# Altium schematic sheet LightLinkV3.SchDoc
size B; SheetNumber: 7; SheetTotal: 8
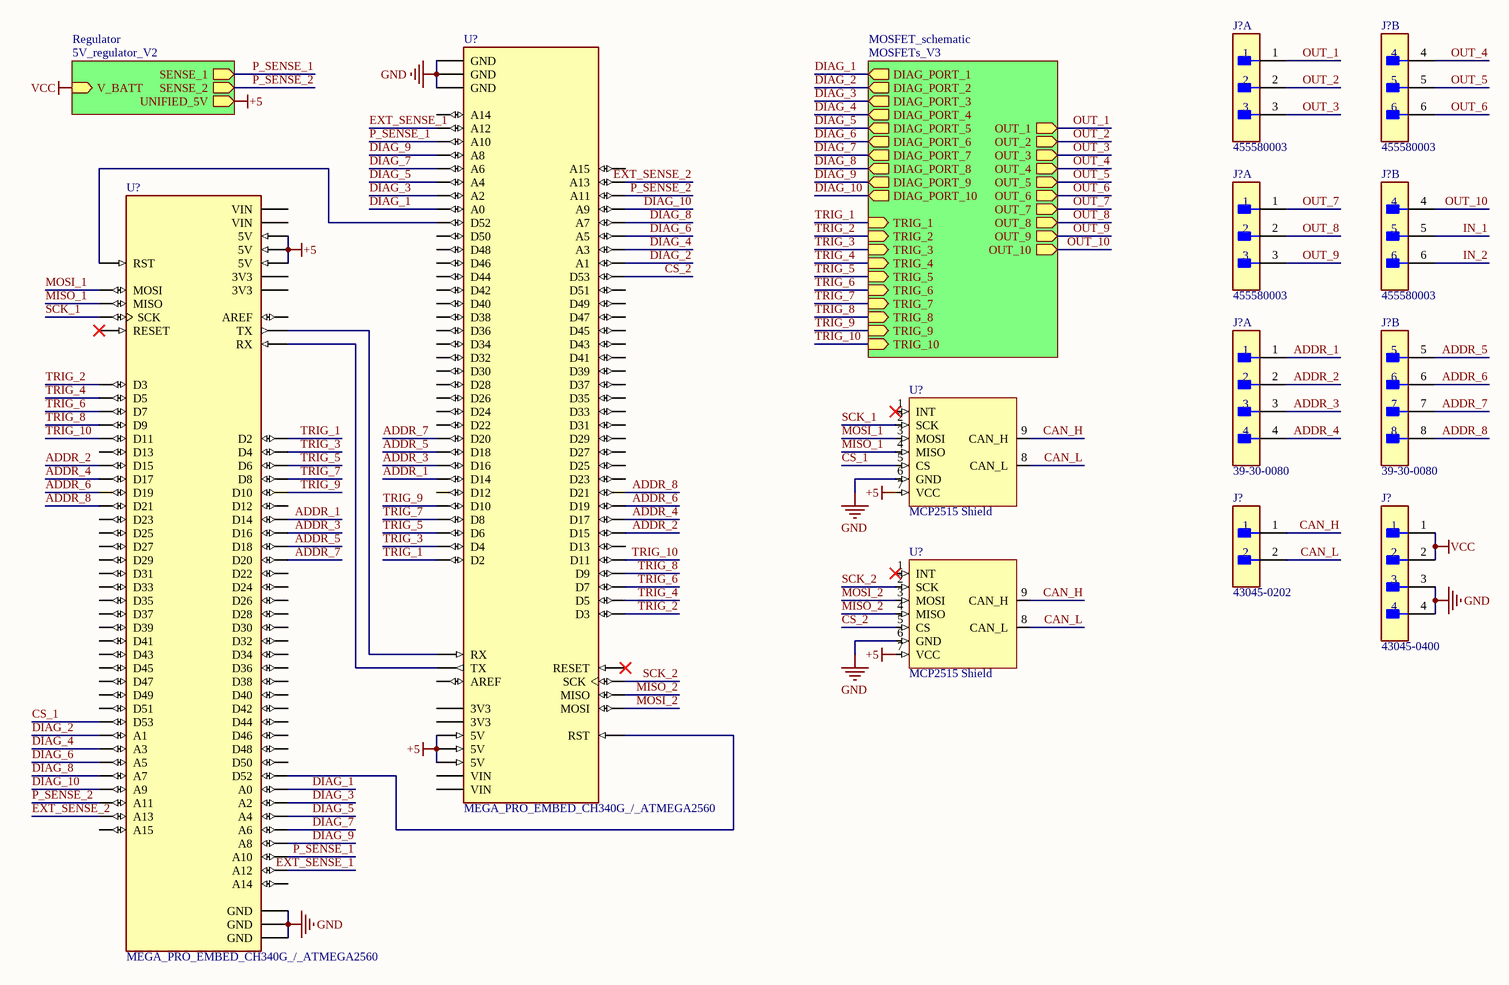
[diagram p0: LightLinkV3.SchDoc]

## Parts
(Parts that share a designator on the sheet are numbered #1, #2 ... from top to bottom, then left to right.)
J?#1  455580003  [FP-455580003-MFG]  (part A of 2)
J?#2  455580003  [FP-455580003-MFG]  (part B of 2)
J?#3  455580003  [FP-455580003-MFG]  (part A of 2)
J?#4  455580003  [FP-455580003-MFG]  (part B of 2)
J?#5  39-30-0080  [FP-39-30-0080-MFG]  (part A of 2)
J?#6  39-30-0080  [FP-39-30-0080-MFG]  (part B of 2)
J?#7  43045-0202  [FP-43045-0202-MFG]
J?#8  43045-0400  [FP-43045-0400-MFG]
U?#1  MCP2515 Shield  [MCP2515 Shield-Footprint-1]
U?#2  MEGA_PRO_EMBED_CH340G_/_ATMEGA2560  [MODULE_MEGA_PRO_EMBED_CH340G_/_ATMEGA2560]
U?#3  MEGA_PRO_EMBED_CH340G_/_ATMEGA2560  [MODULE_MEGA_PRO_EMBED_CH340G_/_ATMEGA2560]
U?#4  MCP2515 Shield  [MCP2515 Shield-Footprint-1]

## Sub-sheets
MOSFET_schematic = MOSFETs_V3: DIAG_PORT_1 (out), TRIG_1 (in), DIAG_PORT_2 (out), TRIG_2 (in), DIAG_PORT_3 (out), TRIG_3 (in), DIAG_PORT_4 (out), TRIG_4 (in), OUT_4 (out), OUT_3 (out), OUT_2 (out), OUT_1 (out), DIAG_PORT_5 (out), TRIG_5 (in), DIAG_PORT_6 (out), TRIG_6 (in), DIAG_PORT_7 (out), TRIG_7 (in), DIAG_PORT_8 (out), TRIG_8 (in), OUT_8 (out), OUT_7 (out), OUT_6 (out), OUT_5 (out), DIAG_PORT_9 (out), TRIG_9 (in), OUT_9 (out), DIAG_PORT_10 (out), TRIG_10 (in), OUT_10 (out)
Regulator = 5V_regulator_V2: UNIFIED_5V (out), V_BATT (in), SENSE_1 (out), SENSE_2 (out)

## Nets
+5: U?#1.7(VCC) U?#2.5V_1(5V) U?#2.5V_2(5V) U?#2.5V_3(5V) U?#3.5V_1(5V) U?#3.5V_2(5V) U?#3.5V_3(5V) U?#4.7(VCC) ; sheet Regulator/UNIFIED_5V
GND: J?#8.3 J?#8.4 U?#1.6(GND) U?#2.GND_1(GND) U?#2.GND_2(GND) U?#2.GND_3(GND) U?#3.GND_1(GND) U?#3.GND_2(GND) U?#3.GND_3(GND) U?#4.6(GND)
VCC: J?#8.1 J?#8.2 ; sheet Regulator/V_BATT
ADDR_1: J?#5.1 U?#2.D14 U?#3.D14
ADDR_2: J?#5.2 U?#2.D15 U?#3.D15
ADDR_3: J?#5.3 U?#2.D16 U?#3.D16
ADDR_4: J?#5.4 U?#2.D17 U?#3.D17
ADDR_5: J?#6.5 U?#2.D18 U?#3.D18
ADDR_6: J?#6.6 U?#2.D19 U?#3.D19
ADDR_7: J?#6.7 U?#2.D20 U?#3.D20
ADDR_8: J?#6.8 U?#2.D21 U?#3.D21
CAN_H: J?#7.1 U?#1.9(CAN_H) U?#4.9(CAN_H)
CAN_L: J?#7.2 U?#1.8(CAN_L) U?#4.8(CAN_L)
CS_1: U?#1.5(CS) U?#3.D53
CS_2: U?#2.D53 U?#4.5(CS)
DIAG_1: U?#2.A0 U?#3.A0 ; sheet MOSFET_schematic/DIAG_PORT_1
DIAG_2: U?#2.A1 U?#3.A1 ; sheet MOSFET_schematic/DIAG_PORT_2
DIAG_3: U?#2.A2 U?#3.A2 ; sheet MOSFET_schematic/DIAG_PORT_3
DIAG_4: U?#2.A3 U?#3.A3 ; sheet MOSFET_schematic/DIAG_PORT_4
DIAG_5: U?#2.A4 U?#3.A4 ; sheet MOSFET_schematic/DIAG_PORT_5
DIAG_6: U?#2.A5 U?#3.A5 ; sheet MOSFET_schematic/DIAG_PORT_6
DIAG_7: U?#2.A6 U?#3.A6 ; sheet MOSFET_schematic/DIAG_PORT_7
DIAG_8: U?#2.A7 U?#3.A7 ; sheet MOSFET_schematic/DIAG_PORT_8
DIAG_9: U?#2.A8 U?#3.A8 ; sheet MOSFET_schematic/DIAG_PORT_9
DIAG_10: U?#2.A9 U?#3.A9 ; sheet MOSFET_schematic/DIAG_PORT_10
EXT_SENSE_1: U?#2.A12 U?#3.A12
EXT_SENSE_2: U?#2.A13 U?#3.A13
IN_1: J?#4.5
IN_2: J?#4.6
MISO_1: U?#1.4(MISO) U?#3.MISO
MISO_2: U?#2.MISO U?#4.4(MISO)
MOSI_1: U?#1.3(MOSI) U?#3.MOSI
MOSI_2: U?#2.MOSI U?#4.3(MOSI)
OUT_1: J?#1.1 ; sheet MOSFET_schematic/OUT_1
OUT_2: J?#1.2 ; sheet MOSFET_schematic/OUT_2
OUT_3: J?#1.3 ; sheet MOSFET_schematic/OUT_3
OUT_4: J?#2.4 ; sheet MOSFET_schematic/OUT_4
OUT_5: J?#2.5 ; sheet MOSFET_schematic/OUT_5
OUT_6: J?#2.6 ; sheet MOSFET_schematic/OUT_6
OUT_7: J?#3.1 ; sheet MOSFET_schematic/OUT_7
OUT_8: J?#3.2 ; sheet MOSFET_schematic/OUT_8
OUT_9: J?#3.3 ; sheet MOSFET_schematic/OUT_9
OUT_10: J?#4.4 ; sheet MOSFET_schematic/OUT_10
P_SENSE_1: U?#2.A10 U?#3.A10 ; sheet Regulator/SENSE_1
P_SENSE_2: U?#2.A11 U?#3.A11 ; sheet Regulator/SENSE_2
SCK_1: U?#1.2(SCK) U?#3.SCK
SCK_2: U?#2.SCK U?#4.2(SCK)
TRIG_1: U?#2.D2 U?#3.D2 ; sheet MOSFET_schematic/TRIG_1
TRIG_2: U?#2.D3 U?#3.D3 ; sheet MOSFET_schematic/TRIG_2
TRIG_3: U?#2.D4 U?#3.D4 ; sheet MOSFET_schematic/TRIG_3
TRIG_4: U?#2.D5 U?#3.D5 ; sheet MOSFET_schematic/TRIG_4
TRIG_5: U?#2.D6 U?#3.D6 ; sheet MOSFET_schematic/TRIG_5
TRIG_6: U?#2.D7 U?#3.D7 ; sheet MOSFET_schematic/TRIG_6
TRIG_7: U?#2.D8 U?#3.D8 ; sheet MOSFET_schematic/TRIG_7
TRIG_8: U?#2.D9 U?#3.D9 ; sheet MOSFET_schematic/TRIG_8
TRIG_9: U?#2.D10 U?#3.D10 ; sheet MOSFET_schematic/TRIG_9
TRIG_10: U?#2.D11 U?#3.D11 ; sheet MOSFET_schematic/TRIG_10
NetU?#2_D52: U?#2.D52 U?#3.RST
NetU?#2_RST: U?#2.RST U?#3.D52
NetU?#2_RX: U?#2.RX U?#3.TX
NetU?#2_TX: U?#2.TX U?#3.RX

Not connected (* = marked no-connect by the designer): U?#1 1(INT)*; U?#2 3V3_1(3V3) 3V3_2(3V3) A14 A15 AREF D12 D13 D22 D23 D24 D25 D26 D27 D28 D29 D30 D31 D32 D33 D34 D35 D36 D37 D38 D39 D40 D41 D42 D43 D44 D45 D46 D47 D48 D49 D50 D51 RESET* VIN_1(VIN) VIN_2(VIN); U?#3 3V3_1(3V3) 3V3_2(3V3) A14 A15 AREF D12 D13 D22 D23 D24 D25 D26 D27 D28 D29 D30 D31 D32 D33 D34 D35 D36 D37 D38 D39 D40 D41 D42 D43 D44 D45 D46 D47 D48 D49 D50 D51 RESET* VIN_1(VIN) VIN_2(VIN); U?#4 1(INT)*

## Library data of the parts
J?#1-J?#4 = CMP-04776-000024-1: CONN HEADER R/A 6POS 4.2MM; Manufacturer: Molex; Standoff Height: 0.4mm; Conn Orientation: Right Angle; Number Of Contacts: 6; Conn Gender: Male; Voltage Rating: 600V; Current Rating: 8A; Footprint Url: https://www.molex.com/pdm_docs/sd/455580003_sd.pdf; Number Of Rows: 2; Lead Free: Yes; Digikey Description: CONN HEADER R/A 6POS 4.2MM; ComponentLink2URL: https://www.molex.com/webdocs/datasheets/pdf/en-us/0455580003_PCB_HEADERS.pdf; Octopart: https://octopart.com/45558-0003-molex-7672845; Package: 0; Device Class L3: unset; ComponentLink2Description: Datasheet; Device Class L2: Headers and Wire Housings; Category: Conn; Contact Material: Tin,Nickel; Mouser Description: Conn Power HDR 6 POS 4.2mm Solder ST Thru-Hole 6 Terminal 1 Port Mini-Fit Jr™ Tray; Manufacturer Part Number: 455580003; Pitch: 4.2mm; Device Class L1: Connectors; Temperature Range Low: -40°C; Temperature: -40°C to +105°C; RoHS: TRUE; Temperature Range High: +105°C; Height: 10.38mm; Automotive: No
J?#5 J?#6 = CMP-04776-000387-1: CONN HEADER R/A 8POS 4.2MM; Number of Contacts: 8; Max Voltage Rating (AC): 600V; Insulation Resistance: 1GR; Contact Resistance: 10mR; Max Current Rating: 7A; Gender: Male; Row Spacing: 0.165inch; Approvals: UL; Number of Ports: 1; Current Rating: 13A; Glow Wire Compliant: Non-compliant; Pitch: 4.2mm; Housing Material: Nylon; Color: Natural; Max Operating Temperature: 105°C; Packaging: Bag; Termination: Solder; Flammability Rating: UL94 V-0; Width: 11.4mm; Contact Plating: Tin; Material: Nylon; Mount: Through Hole; Height: 11.4mm; Halogen Free: Low Halogen; Depth: 19.4mm; ELV: Compliant; Number of Terminals/Pins: 8; Orientation: Right Angle; Number of Positions: 8; Contact Material: Brass; Number of Rows: 2; Lead Free: Lead Free; Contact Type: Male Pin; Min Operating Temperature: -40°C; Fastening Type: Ramp; Package Quantity: 225; Voltage Rating (DC): 600V; Number of Circuits: 8; Housing Color: Natural; Voltage Rating: 600V; Series: Mini-Fit® Jr™ 5569; Contact Gender: Male; Length: 18mm
J?#7 = CMP-04776-000660-1: CONN HEADER R/A 2POS; Number of Contacts: 2; Current Rating: 5A; Gender: Male; Contact Resistance: 10mR; Voltage Rating (DC): 250V; Glow Wire Compliant: Compliant; Voltage Rating: 600V; Pitch: 3mm; Max Voltage Rating (DC): 250.25kV; Insulation Resistance: 1GR; Radiation Hardening: No; Halogen Free: Low Halogen; Number of Positions: 2; Mount: Through Hole; RoHS Compliant: Yes; Lead Free: Contains Lead; Color: Black; Max Current Rating: 5A; Length: 7.15mm; Orientation: Right Angle; Termination: Solder; Height: 8.77mm; Flammability Rating: UL94 V-0; Diameter: 3mm; Min Operating Temperature: -40°C; Series: Micro-Fit 3.0; Max Operating Temperature: 105°C; Number of Circuits: 2; Number of Rows: 2; Depth: 12.2mm; Housing Color: Black; Contact Plating: Gold; Case/Package: SMC; Contact Material: Brass; Packaging: Tray; Housing Material: Thermoplastic; Package Quantity: 3168
J?#8 = CMP-04776-000002-1: CONN HEADER R/A 4POS 3MM; Manufacturer: Molex; Conn Gender: Male; Conn Orientation: Right Angle; Voltage Rating: 600V; Number Of Contacts: 4; Is Female: yes; Current Rating: 8.5A; ComponentLink2URL: https://www.molex.com/webdocs/datasheets/pdf/en-us/0430450400_PCB_HEADERS.pdf; Manufacturer Part Number: 43045-0400; Digikey Description: CONN HEADER R/A 4POS 3MM; Category: Conn; Temperature Range High: +105°C; Lead Free: Yes; Device Class L1: Connectors; Automotive: No; Temperature: -40°C to +105°C; Footprint Url: https://www.molex.com/pdm_docs/sd/430450400_sd.pdf; Height: 9.27mm; Number Of Rows: 2; Device Class L3: unset; Pitch: 3mm; Temperature Range Low: -40°C; Contact Material: Tin,Nickel; Octopart: https://octopart.com/43045-0400-molex-287063; RoHS: TRUE; ComponentLink2Description: Datasheet; Package: 43045-0400; Device Class L2: Headers and Wire Housings
U?#1 U?#4 = CMP-015-00008-2: PCB layout of Arduino MCP2515 shield to avoid remaking the schematic and ordering individual components when I already have a dozen shields on hand.
U?#2 U?#3 = CMP-002-000002-2: Mega 2560 PRO (Embed) CH340G/ATmega2560-16AU; Component Type: Standard; Design Item ID: MEGA_PRO_EMBED_CH340G_/_ATMEGA2560; Price: None; Pin Count: 86; Source: MEGA_PRO_EMBED_CH340G___ATMEGA2560.SchLib; Value: *; Availability: Unavailable; MP: MEGA_PRO_EMBED_CH340G_/_ATMEGA2560; Package: None